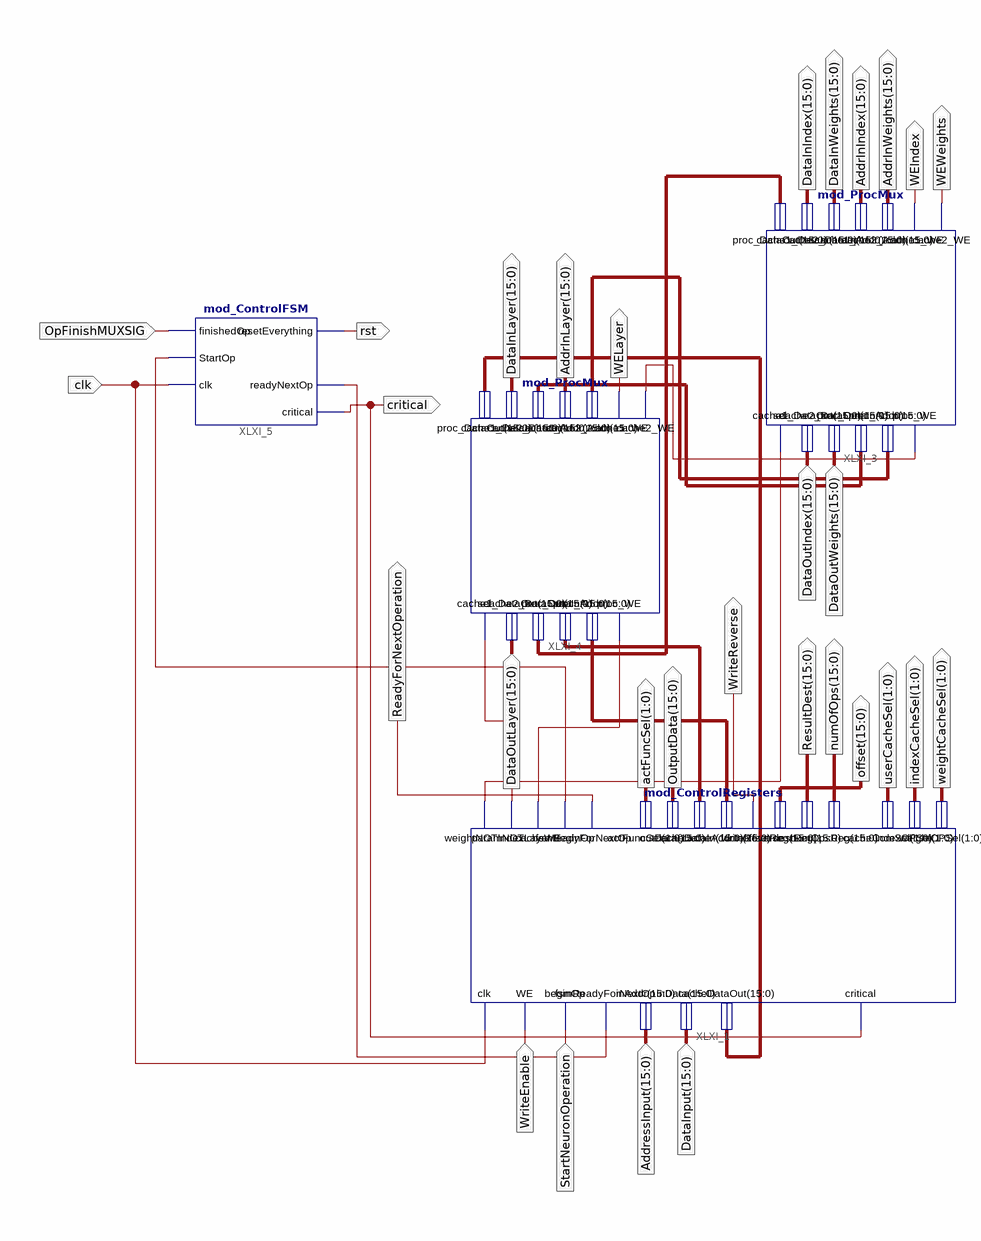
[diagram p0: schematic sheet 1]
// Xilinx ISE schematic mod_Controller.sch (spartan3e) as structural Verilog: 4 symbols, 30 ports
module mod_Controller (
  input  clk,
  input  OpFinishMUXSIG,
  input  StartNeuronOperation,
  input  WriteEnable,
  input  [15:0] AddressInput,
  input  [15:0] DataInput,
  input  [15:0] DataOutLayer,
  input  [15:0] DataOutIndex,
  input  [15:0] DataOutWeights,
  output rst,
  output ReadyForNextOperation,
  output [1:0] actFuncSel,
  output [15:0] OutputData,
  output [15:0] DataInLayer,
  output [15:0] AddrInLayer,
  output WELayer,
  output [15:0] DataInIndex,
  output [15:0] DataInWeights,
  output [15:0] AddrInIndex,
  output [15:0] AddrInWeights,
  output WEIndex,
  output WEWeights,
  output critical,
  output WriteReverse,
  output [15:0] offset,
  output [15:0] ResultDest,
  output [15:0] numOfOps,
  output [1:0] userCacheSel,
  output [1:0] indexCacheSel,
  output [1:0] weightCacheSel
);

  wire ReadyForNextOp, StartOperation, XLXN_3, XLXN_9, XLXN_10, XLXN_27;
  wire [15:0] XLXN_1, XLXN_2, XLXN_8, XLXN_25, XLXN_26, XLXN_28;

  mod_ControlRegisters XLXI_1 (
    .WE(WriteEnable), .beginOp(StartNeuronOperation), .fsmReadyForNextOp(ReadyForNextOp),
    .critical(critical), .clk(clk), .inAddr(AddressInput), .inData(DataInput), .cacheDataOut(XLXN_8),
    .weightNOTIndex(XLXN_10), .paramNOTLayer(XLXN_9), .writeReverse(WriteReverse), .cacheWE(XLXN_3),
    .fsmBeginOp(StartOperation), .readyForNextOp(ReadyForNextOperation), .cacheComSel(userCacheSel),
    .actFuncSel(actFuncSel), .indexOPSel(indexCacheSel), .outData(OutputData), .cacheDataIn(XLXN_1),
    .cacheAddrIn(XLXN_2), .offsetReg(offset), .destReg(ResultDest), .numOpsReg(numOfOps),
    .weightOPSel(weightCacheSel));
  mod_ProcMux XLXI_3 (
    .sel(XLXN_10), .cache1_DataOut(DataOutIndex), .cache2_DataOut(DataOutWeights), .proc_DataIn(XLXN_25),
    .proc_Addr(XLXN_26), .proc_WE(XLXN_27), .proc_DataOut(XLXN_28), .cache1_DataIn(DataInIndex),
    .cache2_DataIn(DataInWeights), .cache1_Addr(AddrInIndex), .cache2_Addr(AddrInWeights),
    .cache1_WE(WEIndex), .cache2_WE(WEWeights));
  mod_ProcMux XLXI_4 (
    .sel(XLXN_9), .cache1_DataOut(DataOutLayer), .cache2_DataOut(XLXN_28), .proc_DataIn(XLXN_1),
    .proc_Addr(XLXN_2), .proc_WE(XLXN_3), .proc_DataOut(XLXN_8), .cache1_DataIn(DataInLayer),
    .cache2_DataIn(XLXN_25), .cache1_Addr(AddrInLayer), .cache2_Addr(XLXN_26), .cache1_WE(WELayer),
    .cache2_WE(XLXN_27));
  mod_ControlFSM XLXI_5 (
    .finishedOp(OpFinishMUXSIG), .StartOp(StartOperation), .clk(clk), .resetEverything(rst),
    .readyNextOp(ReadyForNextOp), .critical(critical));
endmodule
